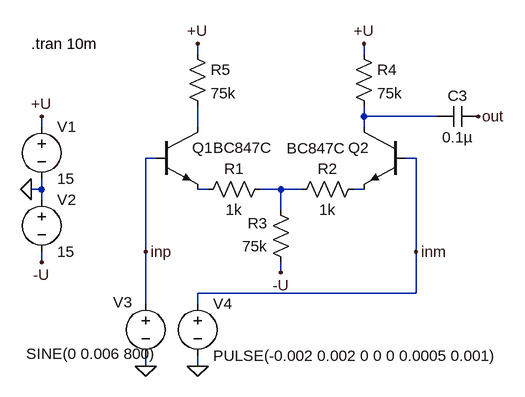
[diagram p0: schematic simple.asc]
simple.asc, the LTspice schematic file:
Version 4
SHEET 1 880 680
WIRE 288 -48 288 -64
WIRE 544 -48 544 -64
WIRE 544 48 544 32
WIRE 656 48 544 48
WIRE 48 64 48 48
WIRE 288 64 288 32
WIRE 544 64 544 48
WIRE 224 112 208 112
WIRE 624 112 608 112
WIRE 48 160 48 144
WIRE 48 160 32 160
WIRE 304 160 288 160
WIRE 416 160 384 160
WIRE 448 160 416 160
WIRE 544 160 528 160
WIRE 48 176 48 160
WIRE 416 192 416 160
WIRE 208 256 208 112
WIRE 624 256 624 112
WIRE 48 272 48 256
WIRE 416 288 416 272
WIRE 624 320 624 256
WIRE 624 320 288 320
WIRE 208 336 208 256
WIRE 288 336 288 320
WIRE 208 432 208 416
WIRE 288 432 288 416
FLAG 32 160 0
FLAG 48 48 +U
FLAG 48 272 -U
FLAG 288 -64 +U
FLAG 544 -64 +U
FLAG 720 48 out
FLAG 208 256 inp
FLAG 624 256 inm
FLAG 208 432 0
FLAG 288 432 0
FLAG 416 288 -U
SYMBOL voltage 48 48 R0
WINDOW 123 0 0 Left 2
WINDOW 39 0 0 Left 2
SYMATTR InstName V1
SYMATTR Value 15
SYMBOL voltage 48 160 R0
WINDOW 123 0 0 Left 2
WINDOW 39 0 0 Left 2
SYMATTR InstName V2
SYMATTR Value 15
SYMBOL npn 224 64 R0
WINDOW 3 88 32 Left 2
SYMATTR InstName Q1
SYMATTR Value BC847C
SYMBOL npn 608 64 M0
WINDOW 3 92 33 Left 2
SYMATTR InstName Q2
SYMATTR Value BC847C
SYMBOL res 400 144 R90
WINDOW 0 0 56 VBottom 2
WINDOW 3 32 56 VTop 2
SYMATTR InstName R1
SYMATTR Value 1k
SYMBOL res 544 144 R90
WINDOW 0 0 56 VBottom 2
WINDOW 3 32 56 VTop 2
SYMATTR InstName R2
SYMATTR Value 1k
SYMBOL res 432 288 R180
WINDOW 0 36 76 Left 2
WINDOW 3 36 40 Left 2
SYMATTR InstName R3
SYMATTR Value 75k
SYMBOL res 528 -64 R0
SYMATTR InstName R4
SYMATTR Value 75k
SYMBOL voltage 208 320 R0
WINDOW 0 -50 14 Left 2
WINDOW 3 -184 93 Left 2
WINDOW 123 0 0 Left 2
WINDOW 39 0 0 Left 2
SYMATTR InstName V3
SYMATTR Value SINE(0 0.006 800)
SYMBOL voltage 288 320 R0
WINDOW 123 0 0 Left 2
WINDOW 39 0 0 Left 2
SYMATTR InstName V4
SYMATTR Value PULSE(-0.002 0.002 0 0 0 0.0005 0.001)
SYMBOL cap 720 32 R90
WINDOW 0 0 32 VBottom 2
WINDOW 3 32 32 VTop 2
SYMATTR InstName C3
SYMATTR Value 0.1µ
SYMBOL res 272 -64 R0
SYMATTR InstName R5
SYMATTR Value 75k
TEXT 32 -64 Left 2 !.tran 10m

The netlist it stands for:
* simple.asc
V1 +U 0 15
V2 0 -U 15
Q1 N002 inp N003 0 BC847C
Q2 N001 inm N005 0 BC847C
R1 N004 N003 1k
R2 N005 N004 1k
R3 -U N004 75k
R4 +U N001 75k
V3 inp 0 SINE(0 0.006 800)
V4 inm 0 PULSE(-0.002 0.002 0 0 0 0.0005 0.001)
C3 out N001 0.1µ
R5 +U N002 75k
.model NPN NPN
.model PNP PNP
.lib standard.bjt
.tran 10m
.backanno
.end